# EAGLE schematic Power Dist RCS (EAGLE 7.7.0)
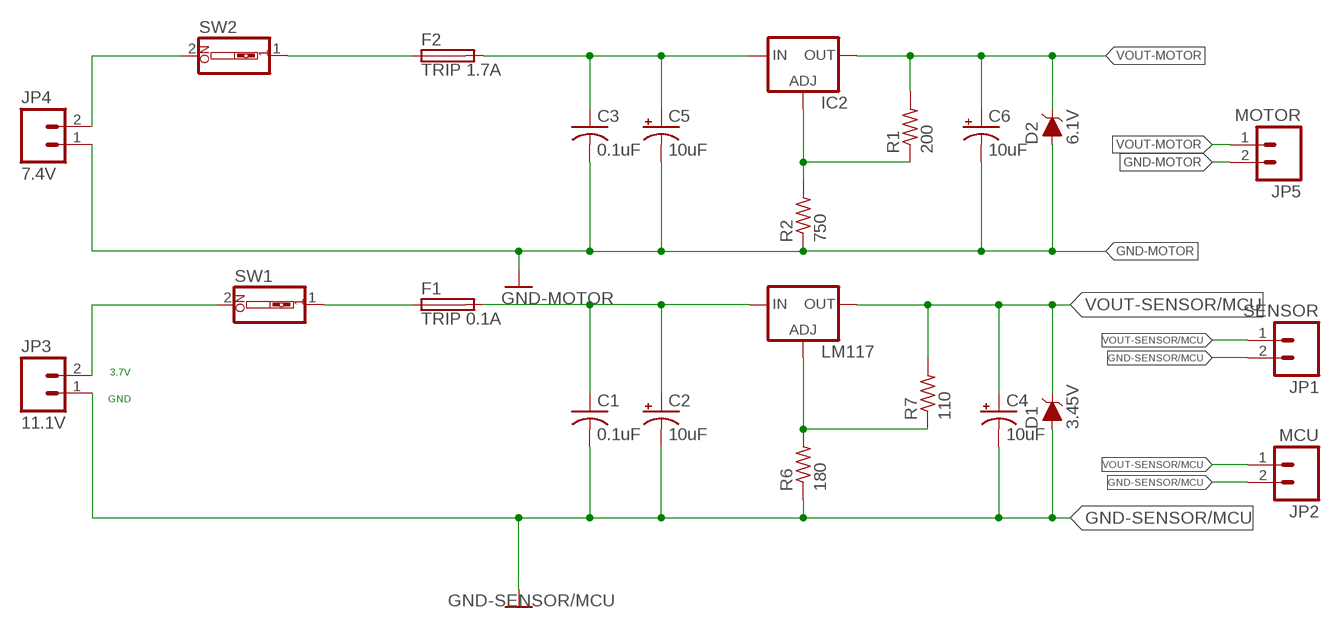
[diagram p0: schematic, sheet 1]

## Parts
C1  0.1uF  C-USC1206  [C1206]
C2  10uF  10UF-POLAR-EIA3216-16V-10%(TANT)  [EIA3216]
C3  0.1uF  C-USC1206  [C1206]
C4  10uF  10UF-POLAR-EIA3216-16V-10%(TANT)  [EIA3216]
C5  10uF  10UF-POLAR-EIA3216-16V-10%(TANT)  [EIA3216]
C6  10uF  10UF-POLAR-EIA3216-16V-10%(TANT)  [EIA3216]
D1  3.45V  DIODE-ZENER-BZT52C3V6S  [SOD-323]
D2  6.1V  DIODE-ZENER-BZT52C3V6S  [SOD-323]
F1  TRIP 0.1A  PICOFUSE  [PICOFUSE]
F2  TRIP 1.7A  PICOFUSE  [PICOFUSE]
IC2  LM317-T039  [TO39-H03]
JP1  SENSOR  M02PTH  [1X02]
JP2  MCU  M02PTH  [1X02]
JP3  11.1V  M02JST-PTH-2  [JST-2-PTH]
JP4  7.4V  M02JST-PTH-2  [JST-2-PTH]
JP5  MOTOR  M02PTH  [1X02]
LM117  LM317-T039  [TO39-H03]
R1  200  R-US_M1206  [M1206]
R2  750  R-US_M1206  [M1206]
R6  180  R-US_M1206  [M1206]
R7  110  R-US_M1206  [M1206]
SW1  SW_DIP-1  [EDG-01]
SW2  SW_DIP-1  [EDG-01]

## Nets
GND-MOTOR: C3.2 C5.- C6.- D2.A JP4.1 JP5.2 R2.1
GND-SENSOR/MCU: C1.2 C2.- C4.- D1.A JP1.2 JP2.2 JP3.1 R6.1
N$1: F1.1 SW1.1
N$2: JP3.2 SW1.2
N$3: JP4.2 SW2.2
N$4: LM117.2(ADJ) R6.2 R7.1
N$5: C1.1 C2.+ F1.2 LM117.1(IN)
N$6: F2.1 SW2.1
N$7: C3.1 C5.+ F2.2 IC2.1(IN)
N$10: IC2.2(ADJ) R1.1 R2.2
VOUT-MOTOR: C6.+ D2.C IC2.3(OUT) JP5.1 R1.2
VOUT-SENSOR/MCU: C4.+ D1.C JP1.1 JP2.1 LM117.3(OUT) R7.2

## Notes on the sheet
- 3.7V
- GND

## Library data of the parts
C1 C3 = rcl:C-US: CAPACITOR, American symbol
C2 C4-C6 = SparkFun-Capacitors:10UF-POLAR: 10.0µF polarized capacitors A capacitor is a passive two-terminal electrical component used to store electrical energy temporarily in an electric field.; PROD_ID: CAP-00811
D1 D2 = SparkFun-DiscreteSemi:DIODE-ZENER: Zener Diode A Zener diode allows current to flow from its anode to its cathode like a normal semiconductor diode, but it also permits current to flow in the reverse direction when its "Zener voltage" is reached. - WIkipedia; PROD_ID: DIO-08199; VALUE: 3.6V
F1 F2 = fuse:PICOFUSE: PICOFUSE 19275, Wickmann; OC_FARNELL: unknown; OC_NEWARK: unknown
IC2 LM117 = v-reg:LM317-T039: VOLTAGE REGULATOR
JP1 JP2 JP5 = SparkFun-Connectors:M02: Standard 2-pin 0.1" header. Use with - straight break away headers ( PRT-00116) - right angle break away headers (PRT-00553) - swiss pins (PRT-00743) - machine pins (PRT-00117) - female headers (PRT-00115) Molex polarized connector foot print use with: PRT-08233 with associated crimp pins and housings. 2.54_SCREWTERM for use with PRT-10571. 3.5mm Screw Terminal footprints for PRT-08084 5mm Screw Terminal footprints for use with PRT-08432
JP3 JP4 = SparkFun-Connectors:M02: Standard 2-pin 0.1" header. Use with - straight break away headers ( PRT-00116) - right angle break away headers (PRT-00553) - swiss pins (PRT-00743) - machine pins (PRT-00117) - female headers (PRT-00115) Molex polarized connector foot print use with: PRT-08233 with associated crimp pins and housings. 2.54_SCREWTERM for use with PRT-10571. 3.5mm Screw Terminal footprints for PRT-08084 5mm Screw Terminal footprints for use with PRT-08432; PROD_ID: CONN-09863; SKU: PRT-09914
R1 R2 R6 R7 = rcl:R-US_: RESISTOR, American symbol
SW1 SW2 = special:SW_DIP-1: DIP SWITCH